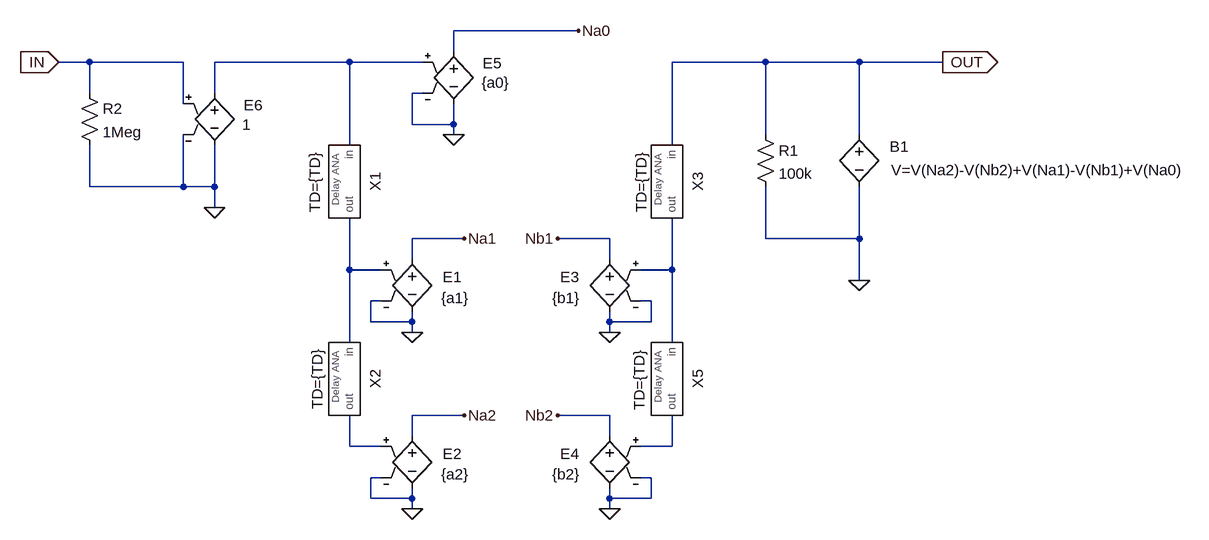
[diagram p0: schematic Type_2_digitalANA.asc]
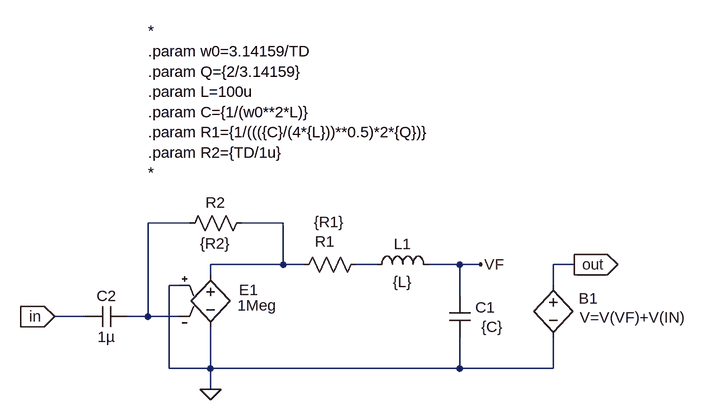
[diagram p1: sub-circuit zminus1ana.asc]
Type_2_digitalANA.asc, the LTspice schematic file:
Version 4
SHEET 1 1788 680
WIRE 544 -368 352 -368
WIRE 352 -336 352 -368
WIRE -208 -320 -256 -320
WIRE -64 -320 -208 -320
WIRE 192 -320 -16 -320
WIRE 304 -320 192 -320
WIRE 832 -320 688 -320
WIRE 976 -320 832 -320
WIRE 1104 -320 976 -320
WIRE -208 -272 -208 -320
WIRE -16 -272 -16 -320
WIRE 304 -272 288 -272
WIRE -64 -256 -64 -320
WIRE 288 -224 288 -272
WIRE 352 -224 352 -256
WIRE 352 -224 288 -224
WIRE 352 -208 352 -224
WIRE 832 -208 832 -320
WIRE 976 -208 976 -320
WIRE 192 -192 192 -320
WIRE 688 -192 688 -320
WIRE -208 -128 -208 -192
WIRE -64 -128 -64 -208
WIRE -64 -128 -208 -128
WIRE -16 -128 -16 -192
WIRE -16 -128 -64 -128
WIRE -16 -96 -16 -128
WIRE 368 -48 288 -48
WIRE 592 -48 512 -48
WIRE 832 -48 832 -128
WIRE 976 -48 976 -128
WIRE 976 -48 832 -48
WIRE 288 -16 288 -48
WIRE 592 -16 592 -48
WIRE 192 0 192 -80
WIRE 240 0 192 0
WIRE 688 0 688 -80
WIRE 688 0 640 0
WIRE 976 16 976 -48
WIRE 240 48 224 48
WIRE 656 48 640 48
WIRE 224 80 224 48
WIRE 288 80 288 64
WIRE 288 80 224 80
WIRE 592 80 592 64
WIRE 656 80 656 48
WIRE 656 80 592 80
WIRE 288 96 288 80
WIRE 592 96 592 80
WIRE 192 112 192 0
WIRE 688 112 688 0
WIRE 368 224 288 224
WIRE 592 224 512 224
WIRE 288 256 288 224
WIRE 592 256 592 224
WIRE 192 272 192 224
WIRE 240 272 192 272
WIRE 688 272 688 224
WIRE 688 272 640 272
WIRE 240 320 224 320
WIRE 656 320 640 320
WIRE 224 352 224 320
WIRE 288 352 288 336
WIRE 288 352 224 352
WIRE 592 352 592 336
WIRE 656 352 656 320
WIRE 656 352 592 352
WIRE 288 368 288 352
WIRE 592 368 592 352
FLAG 288 96 0
FLAG 288 368 0
FLAG 368 -48 Na1
FLAG 368 224 Na2
FLAG 592 96 0
FLAG 592 368 0
FLAG 512 -48 Nb1
FLAG 512 224 Nb2
FLAG 352 -208 0
FLAG 544 -368 Na0
FLAG 976 16 0
FLAG 1104 -320 OUT
IOPIN 1104 -320 Out
FLAG -256 -320 IN
IOPIN -256 -320 In
FLAG -16 -96 0
SYMBOL e 288 -32 R0
WINDOW 0 47 43 Left 2
WINDOW 3 45 75 Left 2
SYMATTR InstName E1
SYMATTR Value {a1}
SYMBOL e 288 240 R0
WINDOW 0 47 43 Left 2
WINDOW 3 45 75 Left 2
SYMATTR InstName E2
SYMATTR Value {a2}
SYMBOL e 592 -32 M0
WINDOW 0 47 43 Left 2
WINDOW 3 45 75 Left 2
SYMATTR InstName E3
SYMATTR Value {b1}
SYMBOL e 592 240 M0
WINDOW 0 47 43 Left 2
WINDOW 3 45 75 Left 2
SYMATTR InstName E4
SYMATTR Value {b2}
SYMBOL e 352 -352 R0
WINDOW 0 45 34 Left 2
WINDOW 3 43 64 Left 2
SYMATTR InstName E5
SYMATTR Value {a0}
SYMBOL bv 976 -224 R0
WINDOW 0 47 34 Left 2
WINDOW 3 49 70 Left 2
SYMATTR InstName B1
SYMATTR Value V=V(Na2)-V(Nb2)+V(Na1)-V(Nb1)+V(Na0)
SYMBOL e -16 -288 R0
WINDOW 0 45 34 Left 2
WINDOW 3 43 64 Left 2
SYMATTR InstName E6
SYMATTR Value 1
SYMBOL Zminus1ANA 688 160 R90
WINDOW 39 9 66 Bottom 2
SYMATTR SpiceLine TD={TD}
SYMATTR InstName X5
SYMBOL Zminus1ANA 192 -144 R90
WINDOW 39 9 69 Bottom 2
SYMATTR SpiceLine TD={TD}
SYMATTR InstName X1
SYMBOL Zminus1ANA 192 160 R90
WINDOW 39 8 65 Bottom 2
SYMATTR SpiceLine TD={TD}
SYMATTR InstName X2
SYMBOL Zminus1ANA 688 -144 R90
WINDOW 39 9 63 Bottom 2
SYMATTR SpiceLine TD={TD}
SYMATTR InstName X3
SYMBOL res 816 -224 R0
SYMATTR InstName R1
SYMATTR Value 100k
SYMBOL res -224 -288 R0
SYMATTR InstName R2
SYMATTR Value 1Meg

zminus1ana.asc, the sub-circuit schematic file:
Version 4
SHEET 1 880 680
WIRE 64 64 0 64
WIRE 208 64 144 64
WIRE 208 128 208 64
WIRE 208 128 96 128
WIRE 240 128 208 128
WIRE 352 128 320 128
WIRE 480 128 432 128
WIRE 512 128 480 128
WIRE 656 128 624 128
WIRE 96 144 96 128
WIRE 48 160 32 160
WIRE 624 160 624 128
WIRE 480 176 480 128
WIRE -96 208 -144 208
WIRE 0 208 0 64
WIRE 0 208 -32 208
WIRE 48 208 0 208
WIRE 32 288 32 160
WIRE 96 288 96 224
WIRE 96 288 32 288
WIRE 480 288 480 240
WIRE 480 288 96 288
WIRE 624 288 624 240
WIRE 624 288 480 288
WIRE 96 320 96 288
FLAG 96 320 0
FLAG 512 128 VF
FLAG 656 128 out
IOPIN 656 128 Out
FLAG -144 208 in
IOPIN -144 208 In
DATAFLAG 640 128 ""
SYMBOL e 96 128 R0
WINDOW 0 44 39 Left 2
WINDOW 3 42 63 Left 2
SYMATTR InstName E1
SYMATTR Value 1Meg
SYMBOL res 336 112 R90
WINDOW 0 -4 64 VBottom 2
WINDOW 3 -65 57 VTop 2
SYMATTR InstName R1
SYMATTR Value {R1}
SYMBOL cap 496 240 R180
WINDOW 0 -39 46 Left 2
WINDOW 3 -51 16 Left 2
SYMATTR InstName C1
SYMATTR Value {C}
SYMBOL res 160 48 R90
WINDOW 0 0 56 VBottom 2
WINDOW 3 32 56 VTop 2
SYMATTR InstName R2
SYMATTR Value {R2}
SYMBOL ind 336 144 R270
WINDOW 0 32 56 VTop 2
WINDOW 3 5 56 VBottom 2
SYMATTR InstName L1
SYMATTR Value {L}
SYMBOL cap -32 192 R90
WINDOW 0 0 32 VBottom 2
WINDOW 3 32 32 VTop 2
SYMATTR InstName C2
SYMATTR Value 1µ
SYMBOL bv 624 144 R0
WINDOW 0 39 36 Left 2
WINDOW 3 41 65 Left 2
SYMATTR InstName B1
SYMATTR Value V=V(VF)+V(IN)
TEXT 0 -232 Left 2 !*\n.param w0=3.14159/TD\n.param Q={2/3.14159}\n.param L=100u\n.param C={1/(w0**2*L)}\n.param R1={1/((({C}/(4*{L}))**0.5)*2*{Q})}\n.param R2={TD/1u}\n*

The netlist it stands for:
* Type_2_digitalANA.asc
E1 Na1 0 N002 0 {a1}
E2 Na2 0 N004 0 {a2}
E3 Nb1 0 N003 0 {b1}
E4 Nb2 0 N005 0 {b2}
E5 Na0 0 N001 0 {a0}
B1 OUT 0 V=V(Na2)-V(Nb2)+V(Na1)-V(Nb1)+V(Na0)
E6 N001 0 IN 0 1
XX5 N003 N005 zminus1ana params: TD={TD}
XX1 N001 N002 zminus1ana params: TD={TD}
XX2 N002 N004 zminus1ana params: TD={TD}
XX3 OUT N003 zminus1ana params: TD={TD}
R1 OUT 0 100k
R2 IN 0 1Meg

* block symbol definitions
.subckt zminus1ana in out
E1 N002 0 0 N001 1Meg
R1 N003 N002 {R1}
C1 0 VF {C}
R2 N002 N001 {R2}
L1 N003 VF {L}
C2 N001 in 1µ
B1 out 0 V=V(VF)+V(IN)
*
.param w0=3.14159/TD
.param Q={2/3.14159}
.param L=100u
.param C={1/(w0**2*L)}
.param R1={1/((({C}/(4*{L}))**0.5)*2*{Q})}
.param R2={TD/1u}
*
.ends zminus1ana

.backanno
.end